# EAGLE design gps_and_sensor_board (EAGLE 8.4.1)
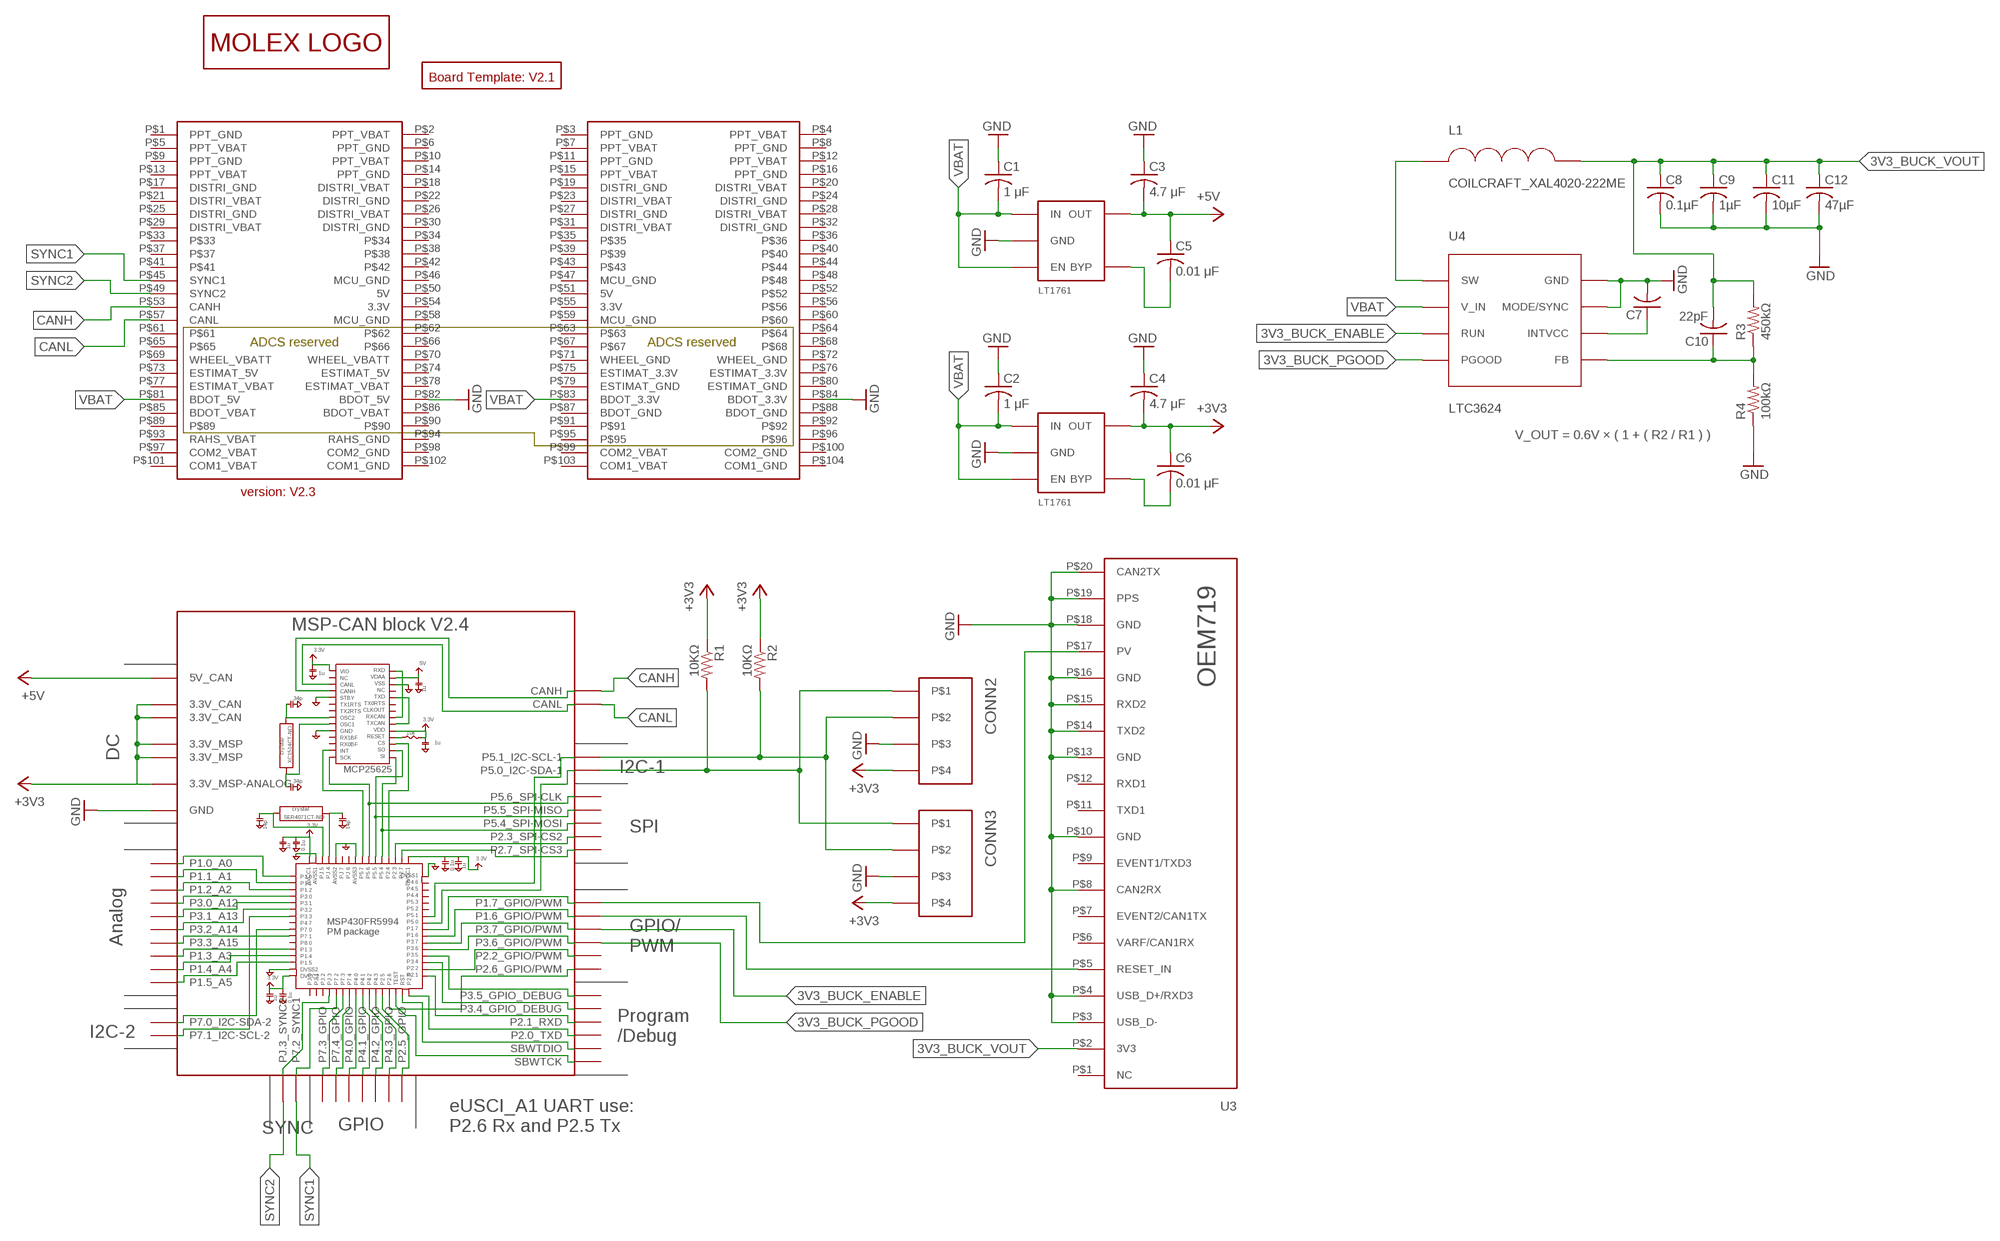
[diagram p0: schematic, sheet 1]

## Parts
B1  BOARD_TEMPLATE1  [BOARD_TEMPLATE]
BLK1  MSP-CAN_BLOCK  [MSP-CAN_BLOCK]
C1  1 μF  C-USC0805  [C0805]
C2  1 μF  C-USC0805  [C0805]
C3  4.7 μF  C-USC0805  [C0805]
C4  4.7 μF  C-USC0805  [C0805]
C5  0.01 μF  C-USC0805  [C0805]
C6  0.01 μF  C-USC0805  [C0805]
C7  C-USC0805  [C0805]
C8  0.1µF  C-USC1206  [C1206]
C9  1µF  C-USC0805  [C0805]
C10  22pF  C-USC0805  [C0805]
C11  10µF  C-USC0805  [C0805]
C12  47µF  C-USC0805  [C0805]
CONN1  PC104_CONNECTOR  [PC104_CONNECTOR]
CONN2  PICOLOCK_4  [PICOLOCK_4]
CONN3  PICOLOCK_4  [PICOLOCK_4]
L1  COILCRAFT_XAL4020-222ME  [COILCRAFT_XAL4020]
R1  10KΩ  R-US_R0805  [R0805]
R2  10KΩ  R-US_R0805  [R0805]
R3  450kΩ  R-US_R0805  [R0805]
R4  100kΩ  R-US_R0805  [R0805]
U1  LINEAR_LDO_LT1761-X  [SOT-23-5]
U2  LINEAR_LDO_LT1761-X  [SOT-23-5]
U3  OEM719  [OEM719]
U4  LTC3624  [LTC3624]
U$1  LOGO_MOLEX  [LOGO_MOLEX]

## Nets
3V3_BUCK_ENABLE: BLK1.P3.7_GPIO/PWM U4.RUN
3V3_BUCK_FB: C10.1 R3.1 R4.2 U4.FB
3V3_BUCK_INTVCC: C7.1 U4.INTVCC
3V3_BUCK_PGOOD: BLK1.P3.6_GPIO/PWM U4.PGOOD
3V3_BUCK_SW: L1.P$1 U4.SW
3V3_BUCK_VOUT: C8.1 C9.1 C10.2 C11.1 C12.1 L1.P$2 R3.2 U3.P$2(3V3)
CANH: BLK1.CANH CONN1.P$53(CANH)
CANL: BLK1.CANL CONN1.P$57(CANL)
GND: BLK1.GND@1(GND) BLK1.GND@2(GND) BLK1.GND@3(GND) BLK1.GND@4(GND) BLK1.GND@5(GND) BLK1.GND@7(GND) BLK1.GND@8(GND) BLK1.GND@9(GND) BLK1.GND@10(GND) BLK1.GND@11(GND) BLK1.GND@12(GND) BLK1.GND@13(GND) BLK1.GND@14(GND) BLK1.GND@15(GND) BLK1.GND@16(GND) BLK1.GND@17(GND) BLK1.GND@26(GND) C1.1 C2.1 C3.1 C4.1 C7.2 C8.2 C9.2 C11.2 C12.2 CONN1.P$82(BDOT_5V) CONN1.P$84(BDOT_3.3V) CONN2.P$3 CONN3.P$3 R4.1 U1.P$2(GND) U2.P$2(GND) U3.P$3(USB_D-) U3.P$4(USB_D+/RXD3) U3.P$8(CAN2RX) U3.P$10(GND) U3.P$13(GND) U3.P$14(TXD2) U3.P$15(RXD2) U3.P$16(GND) U3.P$18(GND) U3.P$19(PPS) U3.P$20(CAN2TX) U4.GND@1(GND) U4.GND@PAD(GND) U4.MODE/SYNC
GPS_POSITION_VALID: BLK1.P1.7_GPIO/PWM U3.P$17(PV)
GPS_RESET_IN: BLK1.P1.6_GPIO/PWM U3.P$5(RESET_IN)
I2C_SCL: BLK1.P5.1_I2C-SCL-1 CONN2.P$2 CONN3.P$2 R2.2
I2C_SDA: BLK1.P5.0_I2C-SDA-1 CONN2.P$1 CONN3.P$1 R1.2
LDO_3V3: BLK1.3.3V@CAN1(3.3V_CAN) BLK1.3.3V@CAN2(3.3V_CAN) BLK1.3.3V@MSP1(3.3V_MSP) BLK1.3.3V@MSP2(3.3V_MSP) BLK1.3.3V_ANALOG@MSP2(3.3V_MSP-ANALOG) C4.2 C6.1 CONN2.P$4 CONN3.P$4 R1.1 R2.1 U2.P$5(OUT) ; supply symbol labelled +3V3
LDO_3V3_BYP: C6.2 U2.P$4(BYP)
LDO_5V: BLK1.5V(5V_CAN) C3.2 C5.1 U1.P$5(OUT) ; supply symbol labelled +5V
LDO_5V_BYP: C5.2 U1.P$4(BYP)
SYNC1: BLK1.P7.2_SYNC1 CONN1.P$45(SYNC1)
SYNC2: BLK1.PJ.3_SYNC2 CONN1.P$49(SYNC2)
VBAT: C1.2 C2.2 CONN1.P$81(BDOT_5V) CONN1.P$83(BDOT_3.3V) U1.P$1(IN) U1.P$3(EN) U2.P$1(IN) U2.P$3(EN) U4.V_IN
Unconnected: BLK1.P1.0_A0 BLK1.P1.1_A1 BLK1.P1.2_A2 BLK1.P1.3_A3 BLK1.P1.4_A4 BLK1.P1.5_A5 BLK1.P2.0_TXD BLK1.P2.1_RXD BLK1.P2.2_GPIO/PWM BLK1.P2.4_SPI-CS2(P2.3_SPI-CS2) BLK1.P2.5_GPIO BLK1.P2.6_GPIO/PWM BLK1.P2.7_SPI-CS3 BLK1.P3.0_A12 BLK1.P3.1_A13 BLK1.P3.2_A14 BLK1.P3.3_A15 BLK1.P3.4_GPIO_DEBUG BLK1.P3.5_GPIO_DEBUG BLK1.P4.0_GPIO BLK1.P4.1_GPIO BLK1.P4.2_GPIO BLK1.P4.3_GPIO BLK1.P5.4_SPI-MOSI BLK1.P5.5_SPI-MISO BLK1.P5.6_SPI-CLK BLK1.P7.0_I2C-SDA-2 BLK1.P7.1_I2C-SCL-2 BLK1.P7.3_GPIO BLK1.P7.4_GPIO BLK1.SBWTCK BLK1.SBWTDIO CONN1.P$1(PPT_GND) CONN1.P$2(PPT_VBAT) CONN1.P$3(PPT_GND) CONN1.P$4(PPT_VBAT) CONN1.P$5(PPT_VBAT) CONN1.P$6(PPT_GND) CONN1.P$7(PPT_VBAT) CONN1.P$8(PPT_GND) CONN1.P$9(PPT_GND) CONN1.P$10(PPT_VBAT) CONN1.P$11(PPT_GND) CONN1.P$12(PPT_VBAT) CONN1.P$13(PPT_VBAT) CONN1.P$14(PPT_GND) CONN1.P$15(PPT_VBAT) CONN1.P$16(PPT_GND) CONN1.P$17(DISTRI_GND) CONN1.P$18(DISTRI_VBAT) CONN1.P$19(DISTRI_GND) CONN1.P$20(DISTRI_VBAT) CONN1.P$21(DISTRI_VBAT) CONN1.P$22(DISTRI_GND) CONN1.P$23(DISTRI_VBAT) CONN1.P$24(DISTRI_GND) CONN1.P$25(DISTRI_GND) CONN1.P$26(DISTRI_VBAT) CONN1.P$27(DISTRI_GND) CONN1.P$28(DISTRI_VBAT) CONN1.P$29(DISTRI_VBAT) CONN1.P$30(DISTRI_GND) CONN1.P$31(DISTRI_VBAT) CONN1.P$32(DISTRI_GND) CONN1.P$33 CONN1.P$34 CONN1.P$35 CONN1.P$36 CONN1.P$37 CONN1.P$38 CONN1.P$39 CONN1.P$40 CONN1.P$41 CONN1.P$42 CONN1.P$43 CONN1.P$44 CONN1.P$46(MCU_GND) CONN1.P$47(MCU_GND) CONN1.P$48 CONN1.P$50(5V) CONN1.P$51(5V) CONN1.P$52 CONN1.P$54(3.3V) CONN1.P$55(3.3V) CONN1.P$56 CONN1.P$58(MCU_GND) CONN1.P$59(MCU_GND) CONN1.P$60 CONN1.P$61 CONN1.P$62 CONN1.P$63 CONN1.P$64 CONN1.P$65 CONN1.P$66 CONN1.P$67 CONN1.P$68 CONN1.P$69(WHEEL_VBATT) CONN1.P$70(WHEEL_VBATT) CONN1.P$71(WHEEL_GND) CONN1.P$72(WHEEL_GND) CONN1.P$73(ESTIMAT_5V) CONN1.P$74(ESTIMAT_5V) CONN1.P$75(ESTIMAT_3.3V) CONN1.P$76(ESTIMAT_3.3V) CONN1.P$77(ESTIMAT_VBAT) CONN1.P$78(ESTIMAT_VBAT) CONN1.P$79(ESTIMAT_GND) CONN1.P$80(ESTIMAT_GND) CONN1.P$85(BDOT_VBAT) CONN1.P$86(BDOT_VBAT) CONN1.P$87(BDOT_GND) CONN1.P$88(BDOT_GND) CONN1.P$89 CONN1.P$90 CONN1.P$91 CONN1.P$92 CONN1.P$93(RAHS_VBAT) CONN1.P$94(RAHS_GND) CONN1.P$95 CONN1.P$96 CONN1.P$97(COM2_VBAT) CONN1.P$98(COM2_GND) CONN1.P$99(COM2_VBAT) CONN1.P$100(COM2_GND) CONN1.P$101(COM1_VBAT) CONN1.P$102(COM1_GND) CONN1.P$103(COM1_VBAT) CONN1.P$104(COM1_GND) U3.P$1(NC) U3.P$6(VARF/CAN1RX) U3.P$7(EVENT2/CAN1TX) U3.P$9(EVENT1/TXD3) U3.P$11(TXD1) U3.P$12(RXD1)

## Notes on the sheet
- V_OUT = 0.6V × ( 1 + ( R2 / R1 ) )

## Library data of the parts
B1 = DubSat1 Components:BOARD_TEMPLATE
BLK1 = DubSat1 Components:MSP-CAN_BLOCK
C1-C12 = rcl:C-US: CAPACITOR, American symbol
CONN1 = DubSat1 Components:PC104_CONNECTOR
CONN2 CONN3 = DubSat1 Components:PICOLOCK_4
L1 = DubSat1 Components:COILCRAFT_XAL4020-222ME
R1-R4 = rcl:R-US_: RESISTOR, American symbol
U1 U2 = DubSat1 Components:LINEAR_LDO_LT1761-X
U3 = DubSat1 Components:OEM719
U4 = DubSat1 Components:LTC3624
U$1 = HuskySat-1 Logos:LOGO_MOLEX

## Net classes
0 default: width 0.254 mm, drill 0.254 mm, clearance 0.152 mm

## Board
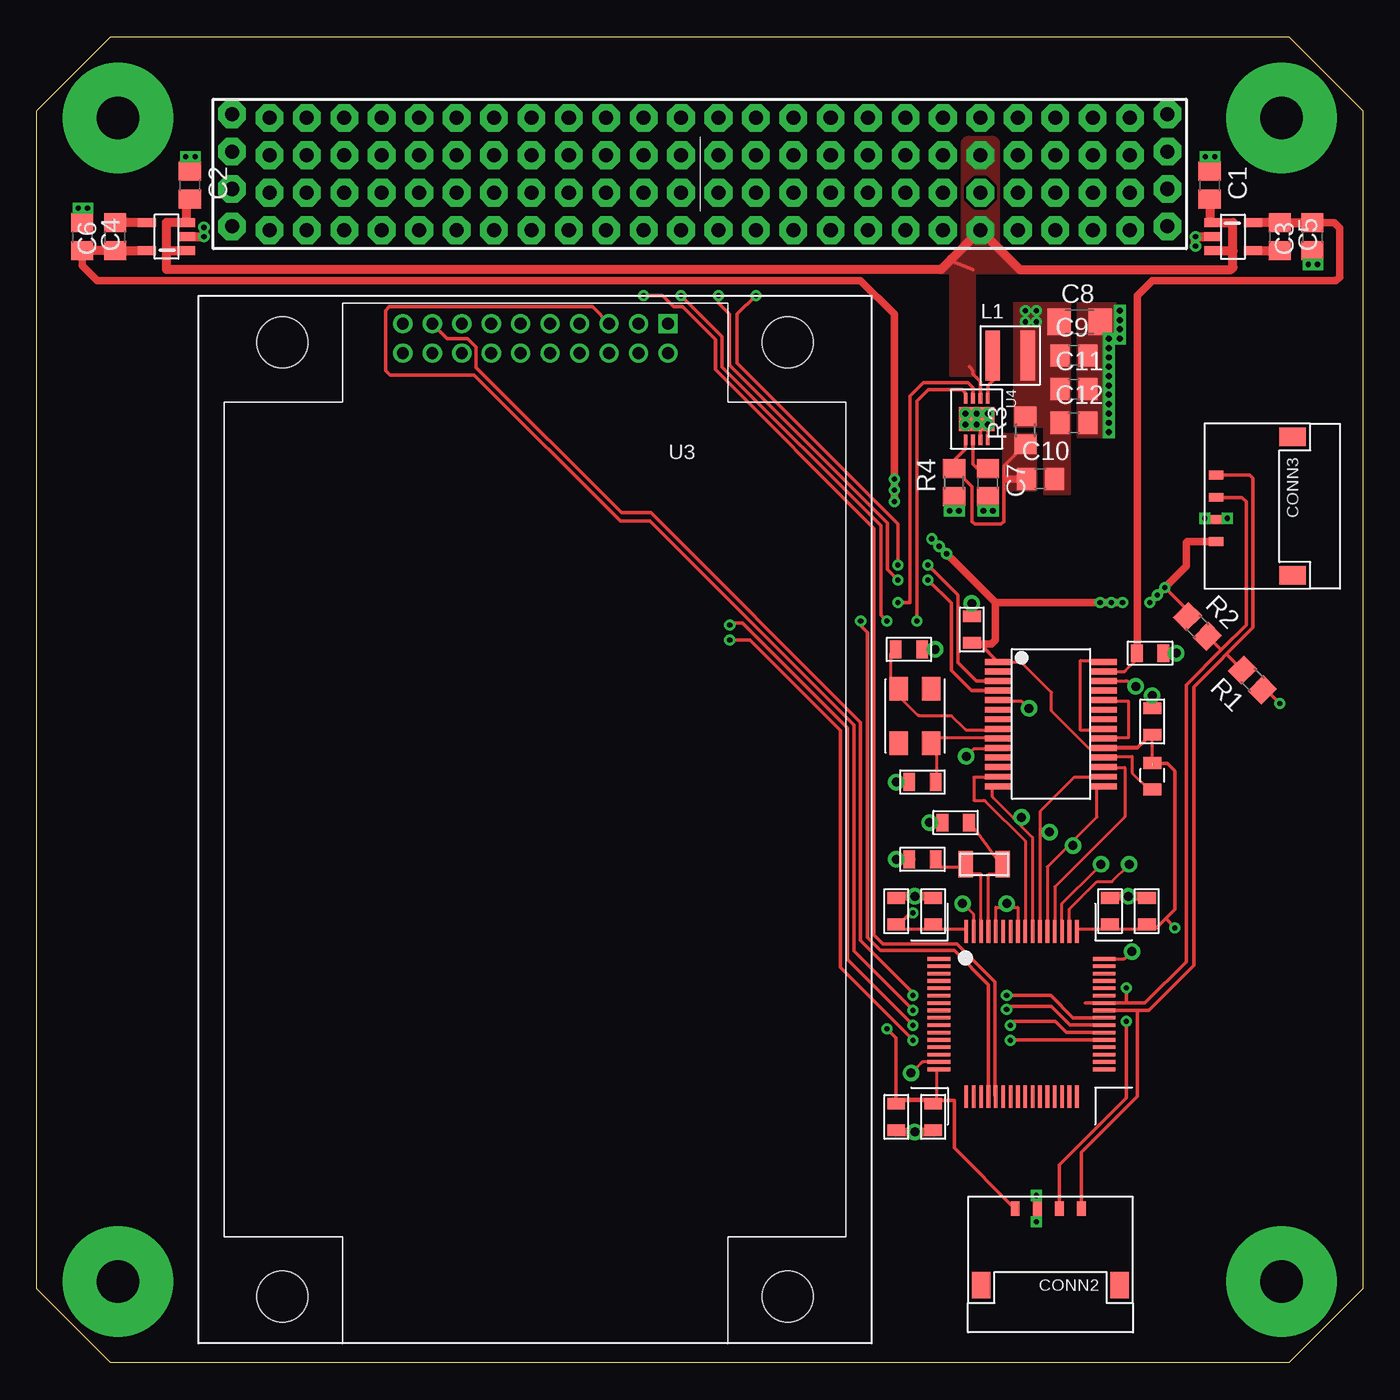
[diagram p1: board, top side]
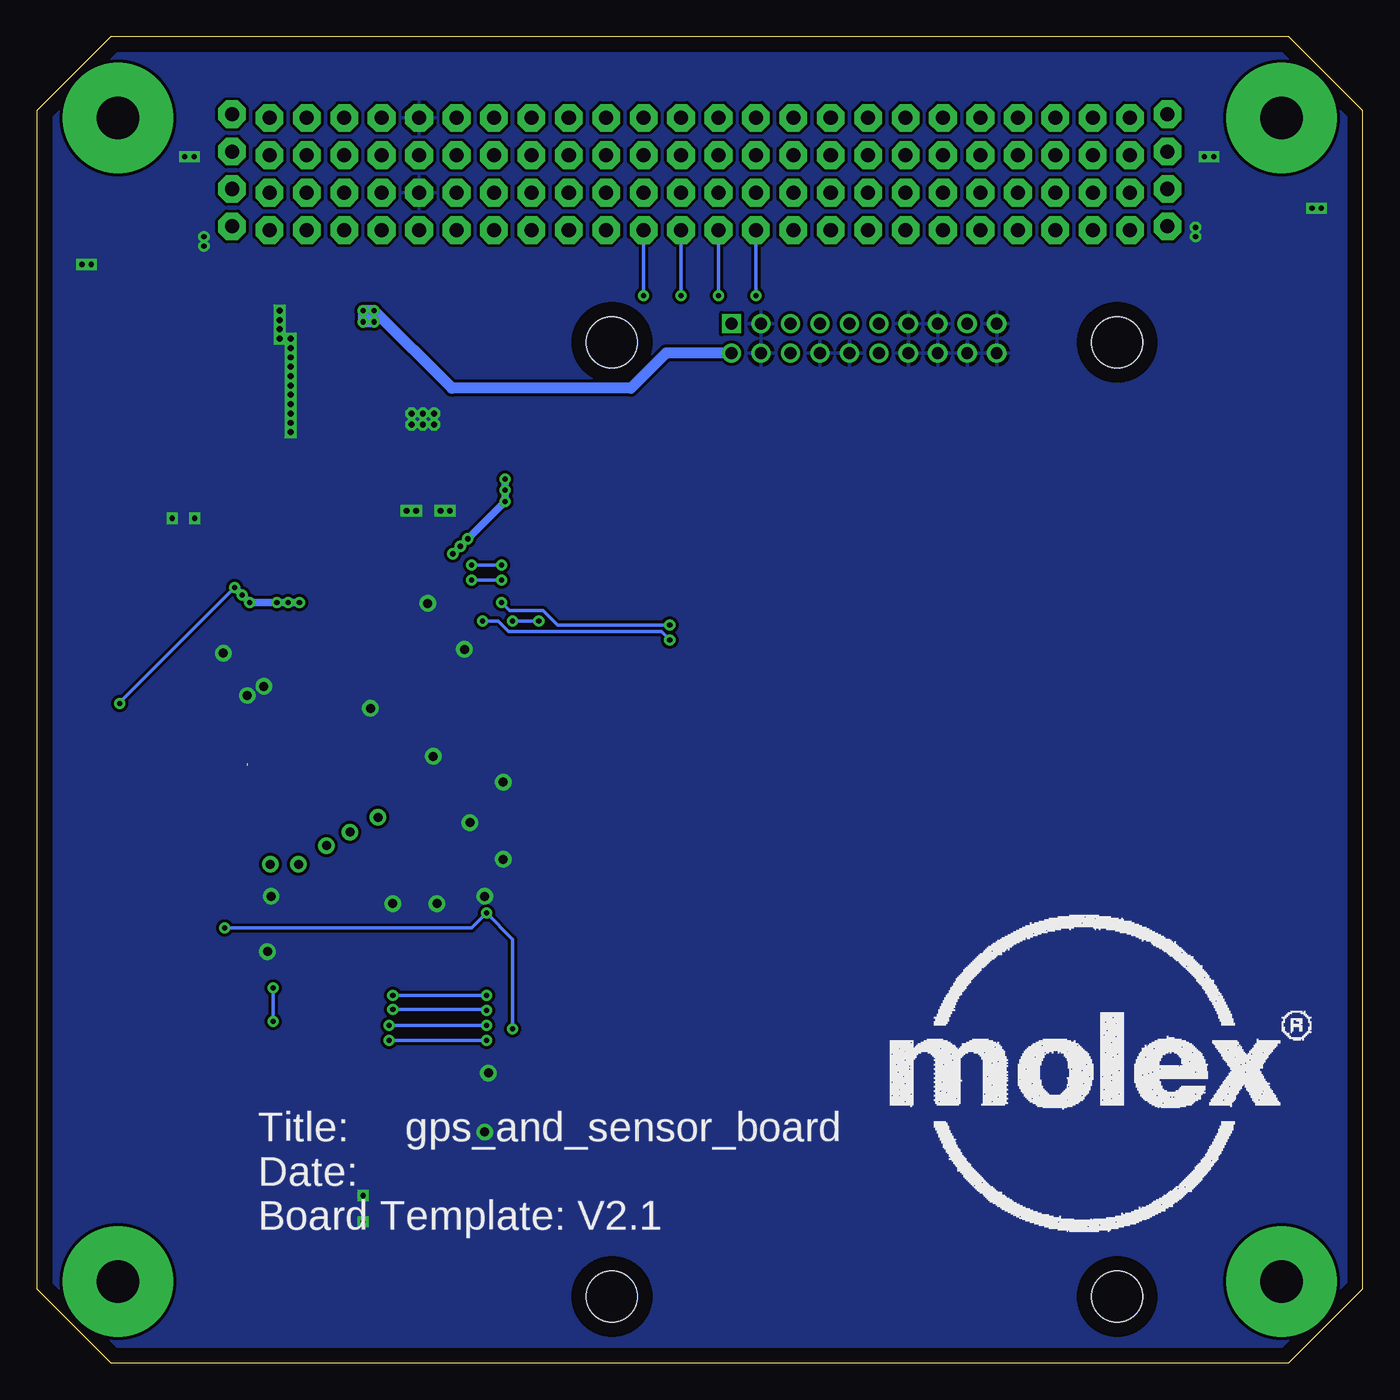
[diagram p2: board, bottom side, seen from below]

Size 90 x 90 mm. Coordinates in mm from the lower left corner, seen from the top.
Copper layers (1*16): Top 0.035mm / dielectric 1.5mm / Bottom 0.035mm
Design rules "default *": minimum track width 8mil, minimum drill 0.4mm, track to track 8mil, track to pad 8mil, pad to pad 8mil, via to via 8mil, smd to smd 8mil, copper to edge 40mil, drill to drill 6mil, minimum pad ring 10mil, minimum via ring 8mil, stop-mask expansion 4mil, vias tented up to drill 0mil, thermal gap 10mil

### Footprints (pad centres in the part's own frame; a part is rotated, then mirrored left to right if it is on the bottom)
BOARD_TEMPLATE = drill 2.9 pad 7.5: P$1 -39.5,39.5; P$2 -39.5,-39.5; P$3 39.5,-39.5; P$4 39.5,39.5
MSP-CAN_BLOCK = smd 1.2 x 0.8: 1 -6,6.08; 2 -6,7.88; 3 -8.5,6.08; 4 -8.5,7.88; 9 -8.5,-6.08; 10 -8.5,-7.88; 11 -6,-6.08; 12 -6,-7.88; 13 8.5,6.08; 14 8.5,7.88; 15 6,6.08; 16 6,7.88; 23 8.875,18.955; 24 8.875,20.755; 25 8.875,17.045; 26 8.875,15.245; 27 -3.375,25.205; 28 -3.375,27.005 | smd 1 x 0.25: 3.3V@CAN1 -3.375,25.125; 3.3V@CAN2 8.875,18.875; 3.3V@MSP1 8.501,5.884; 3.3V@MSP2 -8.533,-5.962; 3.3V_ANALOG@MSP2 -8.482,5.904 | smd 0.8 x 1.2: 5 -5.83,10.5; 6 -7.63,10.5; 7 -3.58,13; 8 -5.38,13; 17 -8.545,24.75; 18 -6.745,24.75; 19 -5.83,15.75; 20 -7.63,15.75; 21 7.83,24.5; 22 9.63,24.5 | smd 0.25 x 1: 5V 7.65,24.5 | smd 1.75 x 0.4: CANH -1.6,21.96; CANL -1.6,22.61; P$65 -1.6,23.91; P$66 -1.6,23.26; P$69 -1.6,21.31; P$70 -1.6,20.66; P$71 -1.6,20.01; P$72 -1.6,19.36; P$73 -1.6,18.71; P$74 -1.6,18.06; P$75 -1.6,17.41; P$76 -1.6,16.76; P$77 -1.6,16.11; P$78 -1.6,15.46; P$79 5.6,15.46; P$80 5.6,16.11; P$81 5.6,16.76; P$82 5.6,17.41; P$83 5.6,18.06; P$84 5.6,18.71; P$85 5.6,19.36; P$86 5.6,20.01; P$87 5.6,20.66; P$88 5.6,21.31; P$89 5.6,21.96; P$90 5.6,22.61; P$91 5.6,23.26; P$92 5.6,23.91 | drill 0.61: GND@1 -3.375,27.875; GND@2 -5.875,24.75; GND@3 -3.75,17.5; GND@4 0.5,20.75; GND@5 -8.5,15.75; GND@7 -8.5,10.5; GND@8 -7.25,8; GND@9 -4,7.5; GND@10 -1,7.5; GND@11 7.75,22.25; GND@12 10.5,24.5; GND@13 8.875,21.625; GND@14 7.25,8; GND@15 7.5,4.25; GND@16 -7.5,-4; GND@17 -7.25,-8; GND@26 -6.25,13; P2.4_SPI-CS2 5.397,10.16; P2.7_SPI-CS3 7.303,10.16; P5.4_SPI-MOSI 3.487,11.434; P5.5_SPI-MISO 1.9,12.354; P5.6_SPI-CLK 0,13.348 | smd 1.55 x 0.25: P1.0_A0 -5.6,3.75; P1.1_A1 -5.6,3.25; P1.2_A2 -5.6,2.75; P1.3_A3 -5.6,-1.75; P1.4_A4 -5.6,-2.25; P1.5_A5 -5.6,-2.75; P1.6_GPIO/PWM 5.6,-0.75; P1.7_GPIO/PWM 5.6,-0.25; P2.1_RXD 5.6,-3.75; P2.2_GPIO/PWM 5.6,-3.25; P3.0_A12 -5.6,2.25; P3.1_A13 -5.6,1.75; P3.2_A14 -5.6,1.25; P3.3_A15 -5.6,0.75; P3.4_GPIO_DEBUG 5.6,-2.75; P3.5_GPIO_DEBUG 5.6,-2.25; P3.6_GPIO/PWM 5.6,-1.75; P3.7_GPIO/PWM 5.6,-1.25; P5.0_I2C-SDA-1 5.6,0.25; P5.1_I2C-SCL-1 5.6,0.75; P7.0_I2C-SDA-2 -5.6,-0.25; P7.1_I2C-SCL-2 -5.6,-0.75; P$8 -5.6,0.25; P$11 -5.6,-1.25; P$15 -5.6,-3.25; P$16 -5.6,-3.75; P$43 5.6,1.25; P$44 5.6,1.75; P$45 5.6,2.25; P$46 5.6,2.75; P$47 5.6,3.25; P$48 5.6,3.75 | smd 0.25 x 1.55: P2.0_TXD 3.75,-5.6; P2.5_GPIO 1.75,-5.6; P2.6_GPIO/PWM 2.25,-5.6; P4.0_GPIO -0.25,-5.6; P4.1_GPIO 0.25,-5.6; P4.2_GPIO 0.75,-5.6; P4.3_GPIO 1.25,-5.6; P7.2_SYNC1 -1.75,-5.6; P7.3_GPIO -1.25,-5.6; P7.4_GPIO -0.75,-5.6; P$17 -3.75,-5.6; P$18 -3.25,-5.6; P$19 -2.75,-5.6; P$49 3.75,5.6; P$50 3.25,5.6; P$51 2.75,5.6; P$52 2.25,5.6; P$53 1.75,5.6; P$54 1.25,5.6; P$55 0.75,5.6; P$56 0.25,5.6; P$57 -0.25,5.6; P$58 -0.75,5.6; P$59 -1.25,5.6; P$60 -1.75,5.6; P$61 -2.25,5.6; P$62 -2.75,5.6; P$63 -3.25,5.6; P$64 -3.75,5.6; PJ.3_SYNC2 -2.25,-5.6; SBWTCK 2.75,-5.6; SBWTDIO 3.25,-5.6 | smd 1 x 1.8: P$93 -3.79,10.16; P$94 -1.29,10.16 | smd 1.25 x 1.6: P$104 -6.13,18.38; P$105 -6.13,22.08; P$106 -8.33,22.08; P$107 -8.33,18.38
C0805 = smd 1.3 x 1.5: 1 -0.95,0; 2 0.95,0
C1206 = smd 1.6 x 1.8: 1 -1.4,0; 2 1.4,0
PC104_CONNECTOR = drill 0.953 pad 1.88 octagon: P$1 -31.75,32.134; P$2 -31.75,34.674; P$3 -31.75,37.214; P$4 -31.75,39.754; P$5 -29.21,31.88; P$6 -29.21,34.42; P$7 -29.21,36.96; P$8 -29.21,39.5; P$9 -26.67,31.88; P$10 -26.67,34.42; P$11 -26.67,36.96; P$12 -26.67,39.5; P$13 -24.13,31.88; P$14 -24.13,34.42; P$15 -24.13,36.96; P$16 -24.13,39.5; P$17 -21.59,31.88; P$18 -21.59,34.42; P$19 -21.59,36.96; P$20 -21.59,39.5; P$21 -19.05,31.88; P$22 -19.05,34.42; P$23 -19.05,36.96; P$24 -19.05,39.5; P$25 -16.51,31.88; P$26 -16.51,34.42; P$27 -16.51,36.96; P$28 -16.51,39.5; P$29 -13.97,31.88; P$30 -13.97,34.42; P$31 -13.97,36.96; P$32 -13.97,39.5; P$33 -11.43,31.88; P$34 -11.43,34.42; P$35 -11.43,36.96; P$36 -11.43,39.5; P$37 -8.89,31.88; P$38 -8.89,34.42; P$39 -8.89,36.96; P$40 -8.89,39.5; P$41 -6.35,31.88; P$42 -6.35,34.42; P$43 -6.35,36.96; P$44 -6.35,39.5; P$45 -3.81,31.88; P$46 -3.81,34.42; P$47 -3.81,36.96; P$48 -3.81,39.5; P$49 -1.27,31.88; P$50 -1.27,34.42; P$51 -1.27,36.96; P$52 -1.27,39.5; P$53 1.27,31.88; P$54 1.27,34.42; P$55 1.27,36.96; P$56 1.27,39.5; P$57 3.81,31.88; P$58 3.81,34.42; P$59 3.81,36.96; P$60 3.81,39.5; P$61 6.35,31.88; P$62 6.35,34.42; P$63 6.35,36.96; P$64 6.35,39.5; P$65 8.89,31.88; P$66 8.89,34.42; P$67 8.89,36.96; P$68 8.89,39.5; P$69 11.43,31.88; P$70 11.43,34.42; P$71 11.43,36.96; P$72 11.43,39.5; P$73 13.97,31.88; P$74 13.97,34.42; P$75 13.97,36.96; P$76 13.97,39.5; P$77 16.51,31.88; P$78 16.51,34.42; P$79 16.51,36.96; P$80 16.51,39.5; P$81 19.05,31.88; P$82 19.05,34.42; P$83 19.05,36.96; P$84 19.05,39.5; P$85 21.59,31.88; P$86 21.59,34.42; P$87 21.59,36.96; P$88 21.59,39.5; P$89 24.13,31.88; P$90 24.13,34.42; P$91 24.13,36.96; P$92 24.13,39.5; P$93 26.67,31.88; P$94 26.67,34.42; P$95 26.67,36.96; P$96 26.67,39.5; P$97 29.21,31.88; P$98 29.21,34.42; P$99 29.21,36.96; P$100 29.21,39.5; P$101 31.75,32.134; P$102 31.75,34.674; P$103 31.75,37.214; P$104 31.75,39.754
PICOLOCK_4 = smd 1.25 x 1.8: MNT@1 -2.605,5.2; MNT@2 6.805,5.2 | smd 0.6 x 1: P$1 0,0; P$2 1.5,0; P$3 3,0; P$4 4.5,0
COILCRAFT_XAL4020 = smd 0.98 x 3.4: P$1 -1.185,0; P$2 1.185,0
R0805 = smd 1.3 x 1.5: 1 -0.95,0; 2 0.95,0
SOT-23-5 = smd 0.6 x 1.2: P$1 -0.95,-1.35; P$2 0,-1.35; P$3 0.95,-1.35; P$4 0.95,1.35; P$5 -0.95,1.35
OEM719 = drill 0.8 square: P$1 69.22,13.84 | drill 0.8: P$2 67.22,13.84; P$3 69.22,15.84; P$4 67.22,15.84; P$5 69.22,17.84; P$6 67.22,17.84; P$7 69.22,19.84; P$8 67.22,19.84; P$9 69.22,21.84; P$10 67.22,21.84; P$11 69.22,23.84; P$12 67.22,23.84; P$13 69.22,25.84; P$14 67.22,25.84; P$15 69.22,27.84; P$16 67.22,27.84; P$17 69.22,29.84; P$18 67.22,29.84; P$19 69.22,31.84; P$20 67.22,31.84 | hole 3.45: 3.18,5.72; 3.18,40.01; 67.95,5.72; 67.95,40.01
LTC3624 = smd 0.7 x 0.25: FB 1.4,-0.75; GND@1 1.4,0.75; INTVCC 1.4,-0.25; MODE/SYNC 1.4,0.25; PGOOD -1.4,-0.75; RUN -1.4,-0.25; SW -1.4,0.75; V_IN -1.4,0.25 | smd 1.65 x 2.38: GND@PAD 0,0

### Placement (x,y rotation side)
B1  45,45 0 top
BLK1  66.84,23.66 0 top
C1  79.61,79.92 270 top
C2  10.39,79.92 270 top
C3  86.59,76.43 90 top
C4  3.09,76.43 270 top
C5  84.37,76.43 270 top
C6  5.31,76.43 90 top
C7  2.2μF  [C0805]  64.56,59.73 270 top
C8  70.78,70.65 0 top
C9  70.4,68.37 0 top
C10  68.11,59.99 0 top
C11  70.4,66.08 0 top
C12  70.4,63.8 0 top
CONN1  45,45 0 top
CONN2  70.91,10.46 180 top
CONN3  80.05,60.24 270 top
L1  66.08,68.37 0 top
R1  2.2KΩ  [R0805]  82.52,46.34 135 top
R2  2.2KΩ  [R0805]  78.78,49.97 315 top
R3  67.1,63.29 90 top
R4  62.27,59.73 90 top
U1  81.2,76.43 270 top
U2  8.81,76.43 90 top
U3  56.68,1.31 90 top
U4  63.8,64.05 270 top
U$1  32.05,8.93 0 bottom

### Tracks (layer width: path | path; a pad name or v marks a point on that pad's centre or on a via)
3V3_BUCK_ENABLE  (via drill 0.35)
  Top 0.254: U4.RUN 63.55,66.19 63.22,66.52 60.17,66.52 59.28,65.62 59.28,51.6 v58.46,51.6 | v66.08,22.9 66.34,23.16 69.13,23.16 69.87,22.41 BLK1.P3.7_GPIO/PWM | v59.48,22.9 59.48,22.92 55.01,27.38 55.01,43.09 47.91,50.2 47.15,50.2 v47.03,50.08
  Bottom 0.254: v66.08,22.9 v59.48,22.9 | v58.46,51.6 57.9,51.04 55.63,51.04 54.67,50.08 v47.03,50.08
3V3_BUCK_FB
  Top 0.254: R3.1 65.64,60.88 65.64,60.11 | 65.64,60.11 65.64,57.11 65.45,56.91 63.67,56.91 63.48,57.11 63.48,59.48 R4.2 62.27,61.26 63.05,62.03 U4.FB | 65.64,60.11 65.77,59.99
  Top 0.508: 65.77,59.99 C10.1
  pour Top (no thermals): 67.86,59.22 67.86,63.03 65.57,63.03 65.57,59.22
3V3_BUCK_INTVCC
  Top 0.254: U4.INTVCC 63.55,61 63.8,60.75 64.49,60.75 C7.1
3V3_BUCK_PGOOD  (via drill 0.35)
  Top 0.254: U4.PGOOD 63.05,65.82 62.8,66.06 60.51,66.06 59.73,65.28 v59.73,50.33 | v66.08,21.89 66.11,21.91 BLK1.P3.6_GPIO/PWM | v59.48,21.89 v59.48,21.9 54.55,26.82 54.55,42.91 48.39,49.06 v47.03,49.06
  Bottom 0.254: v66.08,21.89 v59.48,21.89 | v47.03,49.06 47.59,49.62 57.99,49.62 58.7,50.33 v59.73,50.33
3V3_BUCK_SW
  Top 0.254: U4.SW 64.55,66.34 64.56,66.34 64.9,66.67 L1.P$1
3V3_BUCK_VOUT  (via drill 0.35)
  Bottom 0.762: U3.P$2 47.28,68.53 49.67,66.14 61.82,66.14 v67.1,71.42 | v67.1,71.42 v67.1,70.65 v67.86,70.65 v67.86,71.42 v67.1,71.42
  pour Top (no thermals): 70.15,71.92 66.34,71.92 66.34,63.54 68.37,63.54 68.37,58.97 70.15,58.97
CANH  (via drill 0.35)
  Top 0.254: v46.27,72.43 46.27,71.92 47.03,71.16 47.03,67.72 57.75,57 57.75,53.85 58.46,53.14 v58.46,53.13 | v60.49,53.13 62.07,51.55 62.07,46.98 63.43,45.62 BLK1.CANH
  Bottom 0.254: CONN1.P$53 v46.27,72.43 | v60.49,53.13 v58.46,53.13
CANL  (via drill 0.35)
  Top 0.254: v48.81,72.43 47.54,71.16 47.54,67.86 58.46,56.94 v58.46,54.14 | BLK1.CANL 63.8,46.27 62.53,47.54 62.53,52.11 v60.49,54.14
  Bottom 0.254: CONN1.P$57 v48.81,72.43 | v60.49,54.14 v58.46,54.14
GND  (via drill 0.35, 0.4)
  Top 0.254: U4.GND@1 64.55,63.3 U4.GND@PAD | U4.MODE/SYNC 64.05,63.8 U4.GND@PAD | U4.GND@PAD v63.8,64.43 | v64.25,57.83 64.56,58.13 C7.2 64.89,58.45 v64.89,57.83 | R4.1 61.97,58.48 v61.97,57.83 v62.6,57.83 | v67.86,11.34 67.91,11.3 CONN2.P$3 67.91,9.61 v67.86,9.57 | v79.29,57.32 79.97,57.32 CONN3.P$3 80.73,57.24 v80.81,57.32
  Top 0.305: v3.44,78.36 3.31,77.6 3.25,77.54 | 3.25,77.54 C4.1 | v2.8,78.36 3.25,77.79 3.25,77.54 | v10.74,81.86 10.61,81.09 C2.1 9.98,81.29 v10.1,81.86
  Top 0.61: U1.P$2 v78.66,76.43 v78.66,75.8 | v86.3,74.55 86.59,74.84 C3.1 86.59,74.9 v86.94,74.55 | v79.32,81.86 79.32,81.16 C1.1 79.61,81.51 v79.95,81.86 | U2.P$2 v11.35,76.43 v11.35,77.07
  other vias: 64.56,64.43 64.56,63.67 63.03,64.43 63.8,63.67 63.03,63.67 73.52,71.42 73.52,70.78 73.52,70.15 72.76,69.51 72.76,68.88 72.76,68.24 72.76,67.61 72.76,66.97 72.76,66.34 72.76,65.7 72.76,65.07 72.76,64.43 72.76,63.8 72.76,63.16 73.52,69.51
  pour Bottom: 84.37,89.45 89.45,84.37 89.45,5.63 84.37,0.55 5.63,0.55 0.55,5.63 0.55,84.37 5.63,89.45
  pour Top (no thermals): 72.43,62.78 70.65,62.78 70.65,71.92 73.19,71.92 73.19,69.89 72.43,69.89
GPS_POSITION_VALID  (via drill 0.35)
  Top 0.254: BLK1.P1.7_GPIO/PWM 70.34,23.41 68.82,24.93 v65.83,24.93 | v59.48,24.93 59.48,25.11 55.93,28.67 55.93,43.47 41.7,57.7 39.68,57.7 29.83,67.55 29.83,68.94 29.25,69.52 27.86,69.52 U3.P$17
  Bottom 0.254: v65.83,24.93 v59.48,24.93
GPS_RESET_IN  (via drill 0.35)
  Top 0.254: v65.83,23.97 66.03,24.17 68.88,24.17 70.13,22.91 BLK1.P1.6_GPIO/PWM | v59.48,23.92 59.48,23.93 55.47,27.94 55.47,43.28 41.63,57.12 39.61,57.12 29.7,67.03 23.98,67.03 23.66,67.35 23.66,71.42 23.92,71.67 37.71,71.67 U3.P$5
  Bottom 0.254: v65.83,23.97 59.53,23.97 v59.48,23.92
I2C_SCL  (via drill 0.35)
  Top 0.254: CONN2.P$2 69.41,13.41 73.96,17.96 v73.96,23.16 | 73.96,24.41 BLK1.P5.1_I2C-SCL-1 71.17,24.41 71.16,24.43 | 73.96,24.41 75.21,24.41 78.02,27.22 78.02,46.02 80.43,48.43 | 80.43,48.43 82.08,50.08 82.08,58.46 81.81,58.74 CONN3.P$2 | v73.96,25.44 73.96,24.41 | R2.2 80.33,48.43 80.43,48.43
  Bottom 0.254: v73.96,23.16 v73.96,25.44
I2C_SDA
  Top 0.254: CONN2.P$1 70.91,14.27 74.72,18.08 74.72,23.92 | 74.72,23.92 75.48,23.92 78.53,26.97 78.53,45.88 82.54,49.89 | 74.72,23.92 BLK1.P5.0_I2C-SDA-1 | CONN3.P$1 82.34,60.24 82.54,60.04 82.54,49.89 | R1.2 80.76,48.11 82.54,49.89 | 82.54,49.89
LDO_3V3  (via drill 0.35)  (1 unrouted)
  Top 0.203: BLK1.3.3V@CAN2 75.56,42.54 74.72,41.7 71.42,41.7 68.88,44.24 68.88,45.51 66.84,47.54 65.32,47.54 64.07,48.79 BLK1.3.3V@CAN1
  Top 0.254: CONN2.P$4 62.27,14.59 62.27,17.82 58.43,17.82 BLK1.3.3V@MSP2 58.31,22.04 v57.7,22.65 | v76.57,52.62 78.11,51.08 R2.1 | v84.37,44.75 83.44,45.67 R1.1 | BLK1.3.3V@MSP1 75.39,29.51 75.99,29.51 76.62,30.14 | 76.62,30.14 77.26,30.78 77.26,40.17 76.75,40.68 75.73,40.68 | v59.48,30.52 59.31,30.52 BLK1.3.3V_ANALOG@MSP2 | v77.26,29.51 76.62,30.14
  Top 0.508: C4.2 3.09,74.46 4.11,73.45 55.92,73.45 58.21,71.16 v58.21,58.46 | v60.75,55.92 65.07,51.6 | 65.07,51.6 65.07,49.06 64.79,48.79 BLK1.3.3V@CAN1 | 65.07,51.6 v73.7,51.6 | v75.55,51.6 78.02,54.07 78.02,55.67 78.09,55.74 CONN3.P$4
  Top 0.61: U2.P$5 C6.1 C4.2
  Bottom 0.254: v76.57,52.62 84.37,44.82 v84.37,44.75 | v57.7,22.65 57.7,28.74 v59.48,30.52 60.49,29.51 v77.26,29.51
  Bottom 0.508: v61.76,54.91 v61.26,55.41 v60.75,55.92 v58.21,58.46 v58.21,59.99 v58.21,59.22 | v72.18,51.6 v72.94,51.6 v73.7,51.6 v75.55,51.6 v76.57,52.62 v76.06,52.11
LDO_3V3_BYP
  Top 0.61: U2.P$4 C6.2
LDO_5V
  Top 0.254: 74.72,48.56 74.72,48.39 BLK1.5V
  Top 0.508: C3.2 88.06,77.38 88.43,77 88.43,73.7 88.18,73.45 75.73,73.45 74.72,72.43 74.72,48.56
  Top 0.61: U1.P$5 C5.1 C3.2
LDO_5V_BYP
  Top 0.61: U1.P$4 C5.2
SYNC1  (via drill 0.35)
  Top 0.254: v41.19,72.43 42.46,72.43 43.22,71.67 43.85,71.67 46.07,69.45 46.07,67.39 56.84,56.62 56.84,29.05 57.45,28.44 62.46,28.44 65.05,25.85 65.05,18.11 BLK1.P7.2_SYNC1
  Bottom 0.254: CONN1.P$45 v41.19,72.43
SYNC2  (via drill 0.35)
  Top 0.254: v43.73,72.43 46.52,69.64 46.52,67.58 57.3,56.81 57.3,50.74 v57.7,50.33 | BLK1.PJ.3_SYNC2 64.59,25.66 62.27,27.98 57.26,27.98 56.38,28.86 56.38,49.57 55.92,50.03 v55.92,50.33
  Bottom 0.254: CONN1.P$49 v43.73,72.43 | v55.92,50.33 v57.7,50.33
VBAT
  Top 0.254: U1.P$1 | U2.P$3 | 10.16,78.74 C2.2 | U4.V_IN 64.05,66.59 63.54,67.1 63.54,67.35 63.29,67.61 | 62.08,74.91 62.27,74.72 63.54,74.21
  Top 0.508: 79.61,79.29 C1.2 | U2.P$1
  Top 0.61: U1.P$1 81.2,77.39 81.2,75.48 | 81.2,75.48 81.19,75.48 U1.P$3 | U1.P$1 79.61,77.62 79.61,79.29 | U2.P$3 8.81,77.39 8.81,75.48 | 8.81,75.48 U2.P$1 | 10.16,78.74 U2.P$3 | 81.2,75.48 81.2,74.34 81.07,74.21 66.72,74.21 CONN1.P$81 62.08,74.91 61.38,74.21 8.81,74.21 8.81,75.48
  pour Top (no thermals): 62.78,75.48 62.78,82.72 arc-90 63.29,83.23 64.81,83.23 arc-90 65.32,82.72 65.32,75.48
  pour Top: 61.26,73.96 66.84,73.96 64.81,75.99 63.29,75.99
  pour Top: 63.67,66.97 62.02,66.97 62.02,74.46 63.67,74.46